# Altium schematic sheet 3_RK.SchDoc
size 414 x 293 mm; SheetNumber: 3; SheetTotal: 3
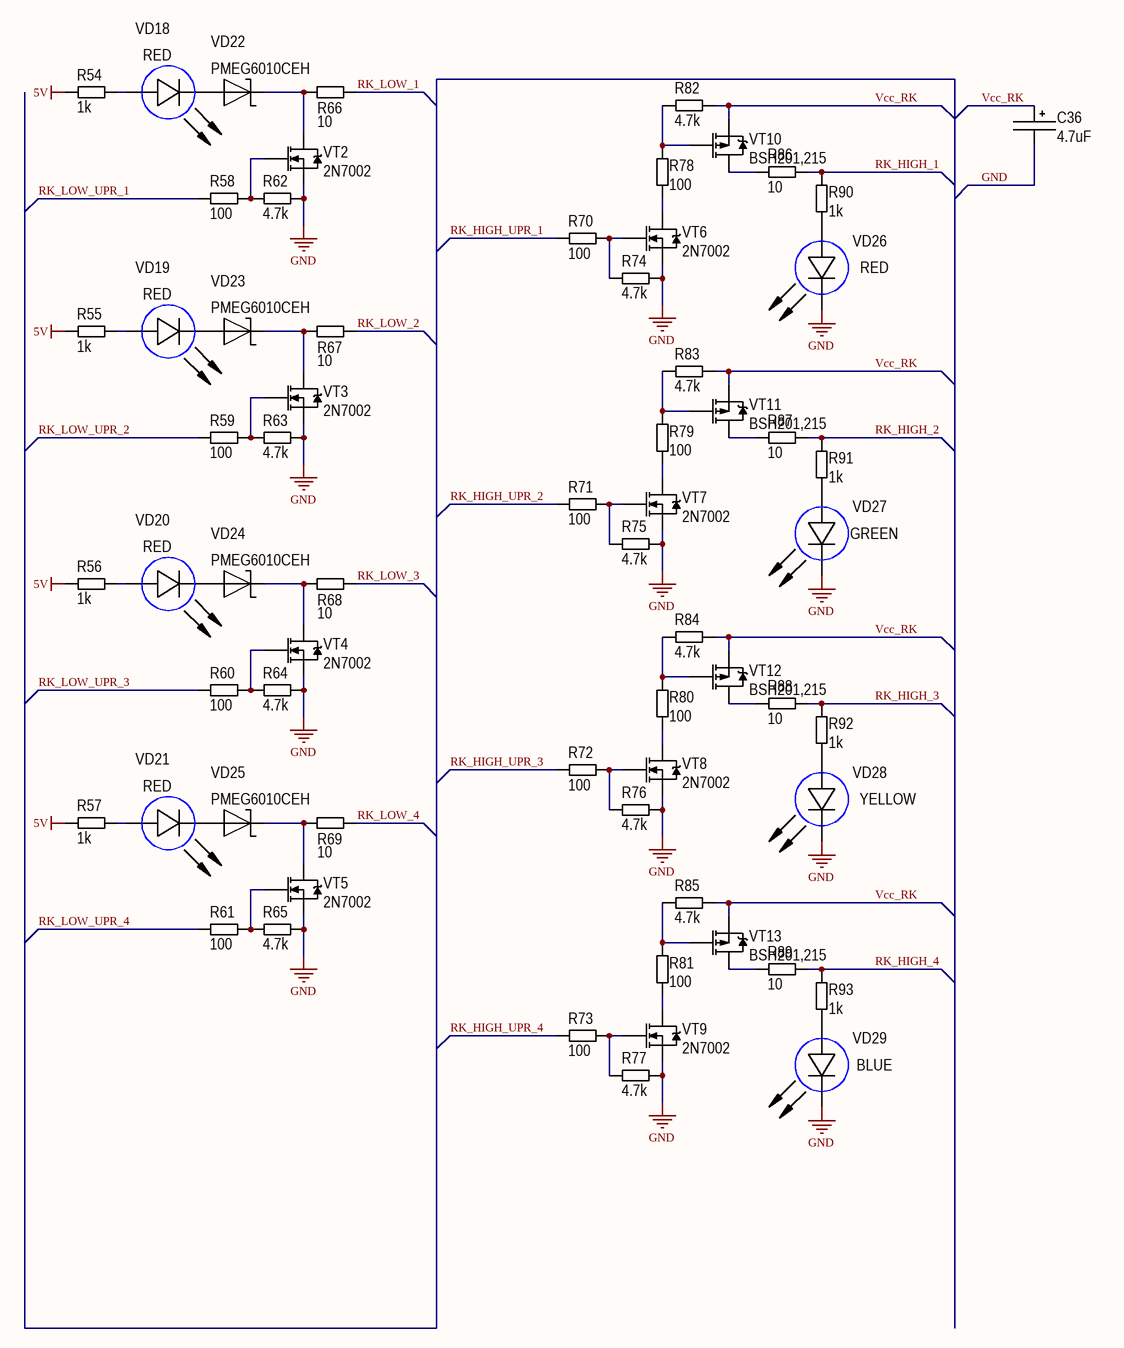
[diagram p0: 3_RK.SchDoc]

## Parts
C36  4.7uF  [TANTAL_C]
R54  1k  [CH0805R]
R55  1k  [CH0805R]
R56  1k  [CH0805R]
R57  1k  [CH0805R]
R58  100  [CH0603R]
R59  100  [CH0603R]
R60  100  [CH0603R]
R61  100  [CH0603R]
R62  4.7k  [CH0603R]
R63  4.7k  [CH0603R]
R64  4.7k  [CH0603R]
R65  4.7k  [CH0603R]
R66  10  [CH0603R]
R67  10  [CH0603R]
R68  10  [CH0603R]
R69  10  [CH0603R]
R70  100  [CH0603R]
R71  100  [CH0603R]
R72  100  [CH0603R]
R73  100  [CH0603R]
R74  4.7k  [CH0603R]
R75  4.7k  [CH0603R]
R76  4.7k  [CH0603R]
R77  4.7k  [CH0603R]
R78  100  [CH0603R]
R79  100  [CH0603R]
R80  100  [CH0603R]
R81  100  [CH0603R]
R82  4.7k  [CH0603R]
R83  4.7k  [CH0603R]
R84  4.7k  [CH0603R]
R85  4.7k  [CH0603R]
R86  10  [CH0603R]
R87  10  [CH0603R]
R88  10  [CH0603R]
R89  10  [CH0603R]
R90  1k  [CH0805R]
R91  1k  [CH0805R]
R92  1k  [CH0805R]
R93  1k  [CH0805R]
VD18  RED  [CH0603LB]
VD19  RED  [CH0603LB]
VD20  RED  [CH0603LB]
VD21  RED  [CH0603LB]
VD22  PMEG6010CEH  [SOD123F]
VD23  PMEG6010CEH  [SOD123F]
VD24  PMEG6010CEH  [SOD123F]
VD25  PMEG6010CEH  [SOD123F]
VD26  RED  [CH0603LB]
VD27  GREEN  [CH0603LB]
VD28  YELLOW  [CH0603LB]
VD29  BLUE  [CH0603LB]
VT2  2N7002  [SOT23_123]
VT3  2N7002  [SOT23_123]
VT4  2N7002  [SOT23_123]
VT5  2N7002  [SOT23_123]
VT6  2N7002  [SOT23_123]
VT7  2N7002  [SOT23_123]
VT8  2N7002  [SOT23_123]
VT9  2N7002  [SOT23_123]
VT10  BSH201,215  [SOT23_123]
VT11  BSH201,215  [SOT23_123]
VT12  BSH201,215  [SOT23_123]
VT13  BSH201,215  [SOT23_123]

## Nets
5V: R54.2 R55.2 R56.2 R57.2
GND: C36.2 R62.1 R63.1 R64.1 R65.1 R74.1 R75.1 R76.1 R77.1 VD26.2(C) VD27.2(C) VD28.2(C) VD29.2(C) VT2.3(S) VT3.3(S) VT4.3(S) VT5.3(S) VT6.3(S) VT7.3(S) VT8.3(S) VT9.3(S)
RK_HIGH_1: R86.1 R90.2
RK_HIGH_2: R87.1 R91.2
RK_HIGH_3: R88.1 R92.2
RK_HIGH_4: R89.1 R93.2
RK_HIGH_UPR_1: R70.2
RK_HIGH_UPR_2: R71.2
RK_HIGH_UPR_3: R72.2
RK_HIGH_UPR_4: R73.2
RK_LOW_1: R66.1
RK_LOW_2: R67.1
RK_LOW_3: R68.1
RK_LOW_4: R69.1
RK_LOW_UPR_1: R58.2
RK_LOW_UPR_2: R59.2
RK_LOW_UPR_3: R60.2
RK_LOW_UPR_4: R61.2
Vcc_RK: C36.1 R82.1 R83.1 R84.1 R85.1 VT10.3(S) VT11.3(S) VT12.3(S) VT13.3(S)
NetR54_1: R54.1 VD18.1(A)
NetR55_1: R55.1 VD19.1(A)
NetR56_1: R56.1 VD20.1(A)
NetR57_1: R57.1 VD21.1(A)
NetR58_1: R58.1 R62.2 VT2.1(G)
NetR59_1: R59.1 R63.2 VT3.1(G)
NetR60_1: R60.1 R64.2 VT4.1(G)
NetR61_1: R61.1 R65.2 VT5.1(G)
NetR66_2: R66.2 VD22.2 VT2.2(D)
NetR67_2: R67.2 VD23.2 VT3.2(D)
NetR68_2: R68.2 VD24.2 VT4.2(D)
NetR69_2: R69.2 VD25.2 VT5.2(D)
NetR70_1: R70.1 R74.2 VT6.1(G)
NetR71_1: R71.1 R75.2 VT7.1(G)
NetR72_1: R72.1 R76.2 VT8.1(G)
NetR73_1: R73.1 R77.2 VT9.1(G)
NetR78_1: R78.1 R82.2 VT10.1(G)
NetR78_2: R78.2 VT6.2(D)
NetR79_1: R79.1 R83.2 VT11.1(G)
NetR79_2: R79.2 VT7.2(D)
NetR80_1: R80.1 R84.2 VT12.1(G)
NetR80_2: R80.2 VT8.2(D)
NetR81_1: R81.1 R85.2 VT13.1(G)
NetR81_2: R81.2 VT9.2(D)
NetR86_2: R86.2 VT10.2(D)
NetR87_2: R87.2 VT11.2(D)
NetR88_2: R88.2 VT12.2(D)
NetR89_2: R89.2 VT13.2(D)
NetR90_1: R90.1 VD26.1(A)
NetR91_1: R91.1 VD27.1(A)
NetR92_1: R92.1 VD28.1(A)
NetR93_1: R93.1 VD29.1(A)
NetVD18_2: VD18.2(C) VD22.1
NetVD19_2: VD19.2(C) VD23.1
NetVD20_2: VD20.2(C) VD24.1
NetVD21_2: VD21.2(C) VD25.1

## Notes on the sheet
- Лист
- Изм.
- № докум.
- Подпись
- Дата

## Library data of the parts
C36 = TantalCap: Model: 293D475X9035C2TE3; Manufacturer: *; HelpURL: *; ComponentKind: *; Value: 4.7uF
R54-R57 R90-R93 = Resistor: Model: CR0805-FX-1001ELF; Manufacturer: *; HelpURL: *; ComponentKind: *; Value: *
R58-R61 R70-R73 R78-R81 = Resistor: Model: CR0603-JW-101ELF; Manufacturer: *; HelpURL: *; ComponentKind: *; Value: 100
R62-R65 R74-R77 R82-R85 = Resistor: Model: CR0603-FX-4701ELF; Manufacturer: *; HelpURL: *; ComponentKind: *; Value: 4.7k
R66-R69 R86-R89 = Resistor: Manufacturer: *; Model: *; HelpURL: *; ComponentKind: *; Value: 10
VD18-VD21 VD26-VD29 = LED_1: Model: KPT-1608SGC; Manufacturer: *; HelpURL: *; ComponentKind: *; Value: *
VD22-VD25 = Diod Schottky: ComponentKind: *; Manufacturer: *; Model: PMEG6010CEH; HelpURL: *
VT2-VT9 = N-chanel: Mosfet; Model: 2N7002; Manufacturer: *; ComponentKind: *; HelpURL: *
VT10-VT13 = P-chanel: Mosfet; Model: BSH201,215; Manufacturer: *; ComponentKind: *; HelpURL: *